# Altium schematic sheet Top_board.schdoc
size 144 x 71 mm
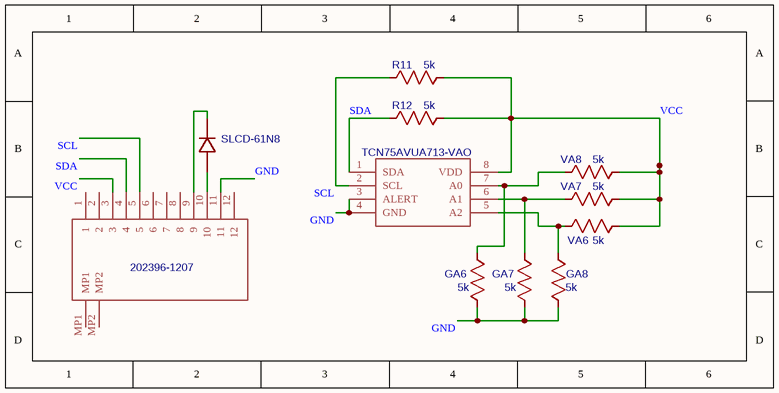
[diagram p0: Top_board.schdoc]

## Parts
D8  SLCD-61N8  [SOD-123_L2.8-W1.8-LS3.7-RD]
GA6  5k  [R0805]
GA7  5k  [R0805]
GA8  5k  [R0805]
IC3  TCN75AVUA713-VAO  [SOP65P490X110-8N]
J2  202396-1207  [2023961207]
R11  5k  [R0805]
R12  5k  [R0805]
VA6  5k  [R0805]
VA7  5k  [R0805]
VA8  5k  [R0805]

## Nets
GND: GA6.1 GA7.1 GA8.1 IC3.3(ALERT) IC3.4(GND) J2.11
SCL: IC3.2(SCL) J2.5 R11.1
SDA: IC3.1(SDA) J2.4 R12.1
VCC: IC3.8(VDD) J2.3 R11.2 R12.2 VA6.2 VA7.2 VA8.2
NetD8_1: D8.1 J2.9
NetD8_2: D8.2 J2.10
NetGA6_2: GA6.2 IC3.7(A0) VA8.1
NetGA7_2: GA7.2 IC3.6(A1) VA7.1
NetGA8_2: GA8.2 IC3.5(A2) VA6.1

Not connected (* = marked no-connect by the designer): J2 1 2 6 7 8 12 MP1 MP2

## Library data of the parts
D8 = SLCD-61N8: BOM_Manufacturer: BLUE ROCKET; BOM_Manufacturer Part: 1N4007W; Contributor: Blothr; BOM_Supplier Part: C328592; spicePre: D; spiceSymbolName: SLCD-61N8
GA6-GA8 R11 R12 VA6-VA8 = 5k: BOM_Manufacturer Part: CRCW08055K00JNTA; BOM_Manufacturer: Vishay / Dale; nameAlias: Value(Ω); Contributor: LCEDA_Lib; BOM_Supplier Part: 71-CRCW0805J-5K; BOM_Supplier: Mouser; spicePre: R; spiceSymbolName: R_0603_US; BOM_Link: https://www.mouser.es/ProductDetail/Vishay-Dale/CRCW08055K00JNTA?qs=%2Fha2pyFadui6t5gBae62ocFJ46SNue422n5luvT1xmc7fnXInubqKA%3D%3D
J2 = 202396-1207: Contributor: tomact; spicePre: J; spiceSymbolName: 202396-1207
IC3 = TCN75AVUA713-VAO: spicePre: I; spiceSymbolName: TCN75AVUA713-VAO